# EAGLE design Cis_Honcho (EAGLE 9.6.0)
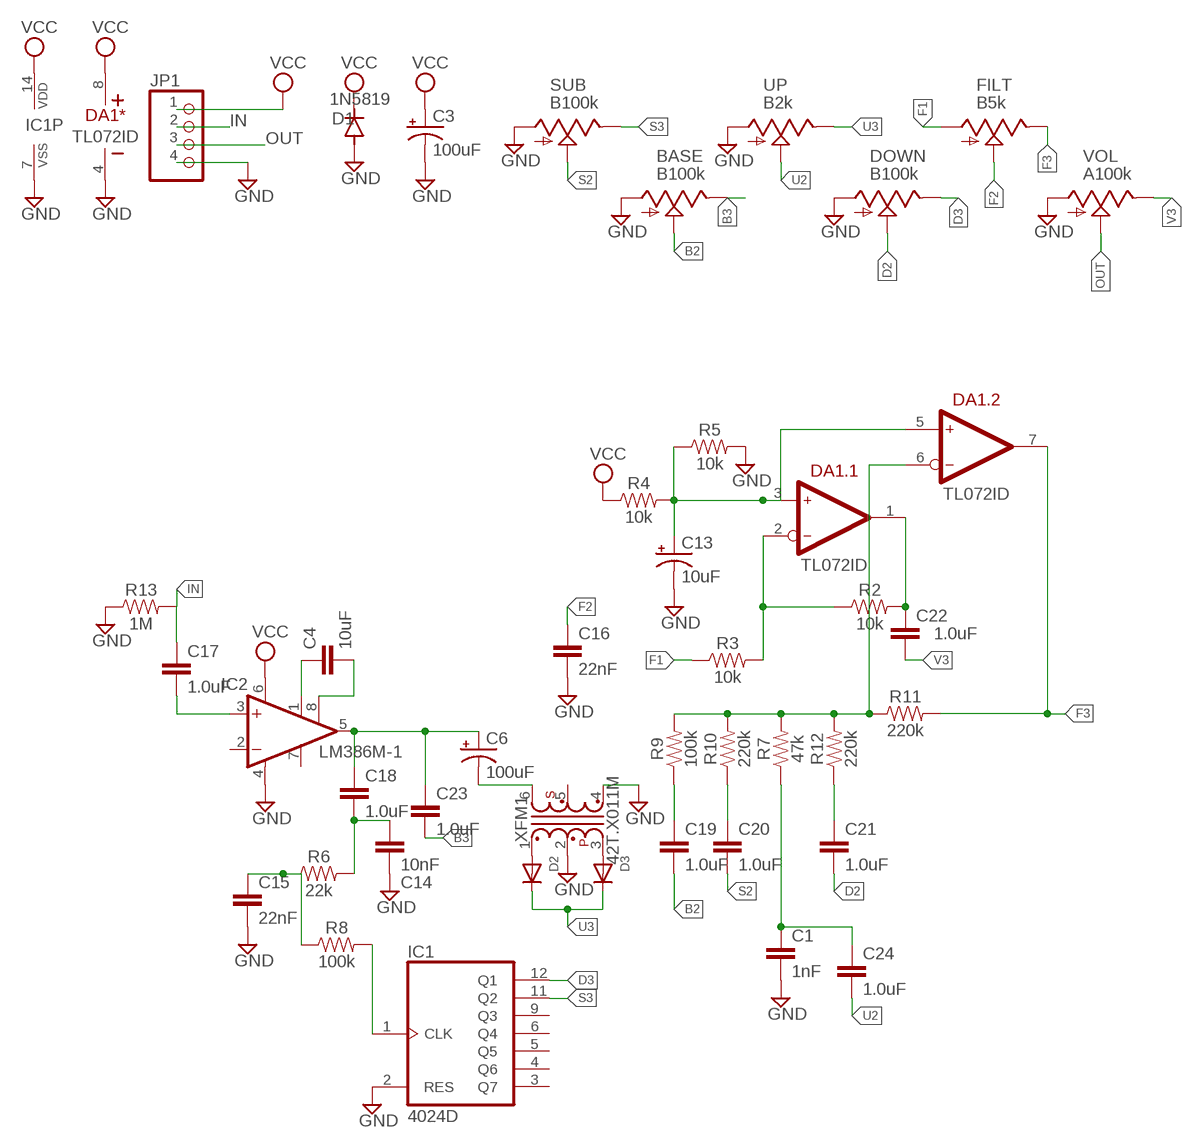
[diagram p0: schematic, sheet 1]

## Parts
BASE  B100k  9MM_SNAP-IN_POT_  [9MM_SNAP-IN_POT]
C1  1nF  1.0NF/1000PF-0603-50V-10%  [0603]
C3  100uF  CPOL-USE2.5-6  [E2,5-6]
C4  10uF  10UF-1210-50V-20%  [1210]
C6  100uF  CPOL-USE2.5-6  [E2,5-6]
C13  10uF  CPOL-USB  [PANASONIC_B]
C14  10nF  10NF-0603-50V-10%  [0603]
C15  22nF  22NF/22,000PF-0603-50V-10%  [0603]
C16  22nF  22NF/22,000PF-0603-50V-10%  [0603]
C17  1.0uF  1.0UF-0603-16V-10%  [0603]
C18  1.0uF  1.0UF-0603-16V-10%  [0603]
C19  1.0uF  1.0UF-0603-16V-10%  [0603]
C20  1.0uF  1.0UF-0603-16V-10%  [0603]
C21  1.0uF  1.0UF-0603-16V-10%  [0603]
C22  1.0uF  1.0UF-0603-16V-10%  [0603]
C23  1.0uF  1.0UF-0603-16V-10%  [0603]
C24  1.0uF  1.0UF-0603-16V-10%  [0603]
D1  1N5819  DIODE-SOD123  [SOD123]
D2  DIODESOD-123  [SOD-123]
D3  DIODESOD-123  [SOD-123]
DA1  TL072ID  [SO-8]
DOWN  B100k  9MM_SNAP-IN_POT_  [9MM_SNAP-IN_POT]
FILT  B5k  9MM_SNAP-IN_POT_  [9MM_SNAP-IN_POT]
IC1  4024D  [SO14]
IC2  LM386M-1  [SO08]
JP1  PINHD-1X4  [1X04]
R2  10k  10KOHM-0603-1/10W-1%  [0603]
R3  10k  10KOHM-0603-1/10W-1%  [0603]
R4  10k  10KOHM-0603-1/10W-1%  [0603]
R5  10k  10KOHM-0603-1/10W-1%  [0603]
R6  22k  22KOHM-0603-1/10W-1%  [0603]
R7  47k  47KOHM-0603-1/10W-1%  [0603]
R8  100k  100KOHM-0603-1/10W-1%  [0603]
R9  100k  100KOHM-0603-1/10W-1%  [0603]
R10  220k  220KOHM-0603-1/10W-1%  [0603]
R11  220k  220KOHM-0603-1/10W-1%  [0603]
R12  220k  220KOHM-0603-1/10W-1%  [0603]
R13  1M  1MOHM-0603-1/4W-5%  [0603]
SUB  B100k  9MM_SNAP-IN_POT_  [9MM_SNAP-IN_POT]
UP  B2k  9MM_SNAP-IN_POT_  [9MM_SNAP-IN_POT]
VOL  A100k  9MM_SNAP-IN_POT_  [9MM_SNAP-IN_POT]
XFM1  42T.X011M  [42TM]

## Nets
B2: BASE.2(S) C19.2
B3: BASE.3(E) C23.2
D2: C21.2 DOWN.2(S)
D3: DOWN.3(E) IC1.12(Q1)
F1: FILT.1(A) R3.1
F2: C16.1 FILT.2(S)
F3: DA1.7(.2:OUT) FILT.3(E) R11.2
GND: BASE.1(A) C1.2 C3.- C13.- C14.2 C15.2 C16.2 D1.A DA1.4(*:V-) DOWN.1(A) IC1.2(RES) IC1.7(VSS) IC2.4(GND) JP1.4 R5.2 R13.1 SUB.1(A) UP.1(A) VOL.1(A) XFM1.2 XFM1.4
IN: C17.1 JP1.2 R13.2
N$1: C17.2 IC2.3(+IN)
N$2: C4.1 IC2.1(GAIN)
N$3: C4.2 IC2.8(GAIN)
N$4: C6.+ C18.1 C23.1 IC2.5(OUT)
N$5: C14.1 C18.2 R6.2
N$6: C15.1 R6.1 R8.1
N$7: IC1.1(CLK) R8.2
N$8: C6.- XFM1.6
N$9: D2.A XFM1.1
N$10: D3.A XFM1.3
N$11: DA1.6(.2:IN-) R7.2 R9.2 R10.2 R11.1 R12.2
N$12: C19.1 R9.1
N$13: C20.1 R10.1
N$14: C21.1 R12.1
N$15: C1.1 C24.1 R7.1
N$16: C13.+ DA1.3(.1:IN+) DA1.5(.2:IN+) R4.2 R5.1
N$17: C22.1 DA1.1(.1:OUT) R2.2
N$18: DA1.2(.1:IN-) R2.1 R3.2
OUT: JP1.3 VOL.2(S)
S2: C20.2 SUB.2(S)
S3: IC1.11(Q2) SUB.3(E)
U2: C24.2 UP.2(S)
U3: D2.C D3.C UP.3(E)
V3: C22.2 VOL.3(E)
VCC: C3.+ D1.C DA1.8(*:V+) IC1.14(VDD) IC2.6(VS) JP1.1 R4.1
Unconnected: IC1.3(Q7) IC1.4(Q6) IC1.5(Q5) IC1.6(Q4) IC1.9(Q3) IC2.2(-IN) IC2.7(BYPASS) XFM1.5

## Library data of the parts
BASE DOWN FILT SUB UP VOL = MusicThingModular:9MM_SNAP-IN_POT: 9mm vertical snap-in pot, Alpha / Panasonic style
C1 = SparkFun-Capacitors:1.0NF/1000PF: 1nF/1,000pF ceramic capacitors A capacitor is a passive two-terminal electrical component used to store electrical energy temporarily in an electric field.; PROD_ID: CAP-07886
C3 C6 = adafruit:CPOL-US: POLARIZED CAPACITOR, American symbol
C4 = SparkFun-Capacitors:10UF: 10.0µF ceramic capacitors A capacitor is a passive two-terminal electrical component used to store electrical energy temporarily in an electric field.; PROD_ID: CAP-09824
C13 = rcl:CPOL-US: POLARIZED CAPACITOR, American symbol; SPICEPREFIX: C
C14 = SparkFun-Capacitors:10NF: 0.01uF/10nF/10,000pF ceramic capacitors A capacitor is a passive two-terminal electrical component used to store electrical energy temporarily in an electric field. CAP-09321; PROD_ID: CAP-00867
C15 C16 = SparkFun-Capacitors:22NF/22,000PF: 0.022uF/22nF/22,000pF ceramic capacitors A capacitor is a passive two-terminal electrical component used to store electrical energy temporarily in an electric field.; PROD_ID: CAP-07885
C17-C24 = SparkFun-Capacitors:1.0UF: 1µF ceramic capacitors A capacitor is a passive two-terminal electrical component used to store electrical energy temporarily in an electric field.; PROD_ID: CAP-00868
D1 = diode:DIODE-: DIODE
D2 D3 = adafruit:DIODE: Diode SMADIODE - SMA Surface Mount Package 20V 1A Schottky Diode Digikey: 641-1014-6-ND DO-1N4148 - Through Hole Small Current Diode SOD-123 20V 1 A (.5mV Vf) Schottky Diode - Digikey: MBRX120TPMSCT-ND SOD-323 10V 570mA (.38mV Vf, 3ns) Schottky Diode - Digikey: ZLLS410CT-ND SOD-523 30V 30mA Schottky Diode (RB751S-40TE61) - Digikey: RB751S-40TE61CT-ND SOT23-R/W - SOT23 Package (R = Solder Paste/Reflow Ovens, W = Hand-Soldering) BAT54Film 40V 300mA - Digikey: 497-7162-1-ND
DA1 = ic-ti:TL072; MOUSER: 511-TL072IDT
IC1 = 40xx:4024: 7-stage binary/ripple COUNTER
IC2 = linear:LM386?-*: Low Voltage Audio Power Amplifier Source: http://cache.national.com/ds/LM/LM386.pdf
JP1 = Connector:PINHD-1X4: PIN HEADER; CATEGORY: CONNECTOR; SUB-CATEGORY: PIN-HEADER
R2-R5 = SparkFun-Resistors:10KOHM: 10kΩ resistor A resistor is a passive two-terminal electrical component that implements electrical resistance as a circuit element. Resistors act to reduce current flow, and, at the same time, act to lower voltage levels within circuits. - Wikipedia; PROD_ID: RES-00824
R6 = SparkFun-Resistors:22KOHM: 22kΩ resistor A resistor is a passive two-terminal electrical component that implements electrical resistance as a circuit element. Resistors act to reduce current flow, and, at the same time, act to lower voltage levels within circuits. - Wikipedia; PROD_ID: RES-07853
R7 = SparkFun-Resistors:47KOHM: 47kΩ resistor A resistor is a passive two-terminal electrical component that implements electrical resistance as a circuit element. Resistors act to reduce current flow, and, at the same time, act to lower voltage levels within circuits. - Wikipedia; PROD_ID: RES-07871
R8 R9 = SparkFun-Resistors:100KOHM: 100kΩ resistor A resistor is a passive two-terminal electrical component that implements electrical resistance as a circuit element. Resistors act to reduce current flow, and, at the same time, act to lower voltage levels within circuits. - Wikipedia; PROD_ID: RES-07828
R10-R12 = SparkFun-Resistors:220KOHM: 220kΩ resistor A resistor is a passive two-terminal electrical component that implements electrical resistance as a circuit element. Resistors act to reduce current flow, and, at the same time, act to lower voltage levels within circuits. - Wikipedia; PROD_ID: RES-08969
R13 = SparkFun-Resistors:1MOHM: 1MΩ resistor A resistor is a passive two-terminal electrical component that implements electrical resistance as a circuit element. Resistors act to reduce current flow, and, at the same time, act to lower voltage levels within circuits. - Wikipedia; PROD_ID: RES-07868
XFM1 = transformer:42T.X: Xicon Micro-Mini EI-12 Audio Transformers 42TL/42TC/42TM Series Source: http://www.mouser.com//catalog/specsheets/164201.pdf http://www.mouser.com/catalog/specsheets/114225.pdf http://www.mouser.com/catalog/specsheets/164267.pdf

## Board
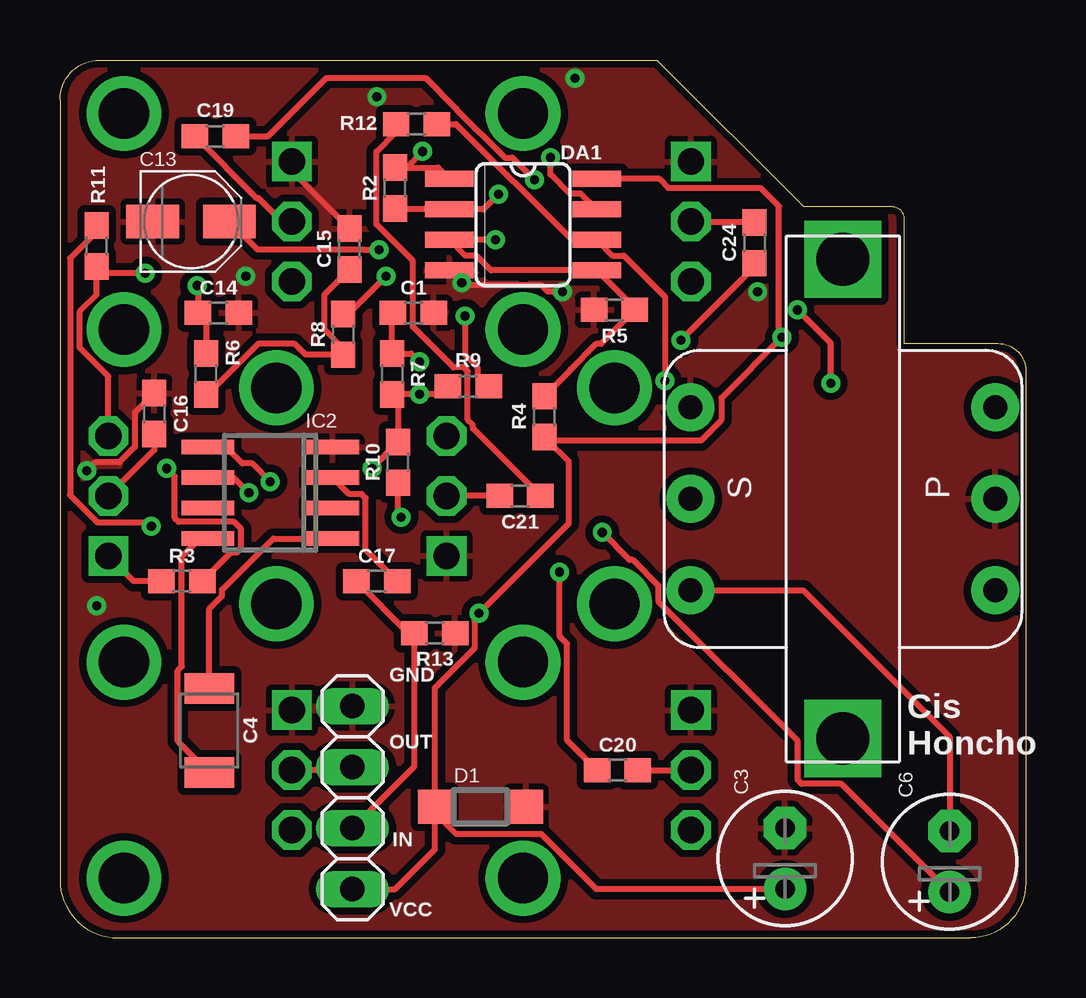
[diagram p1: board, top side]
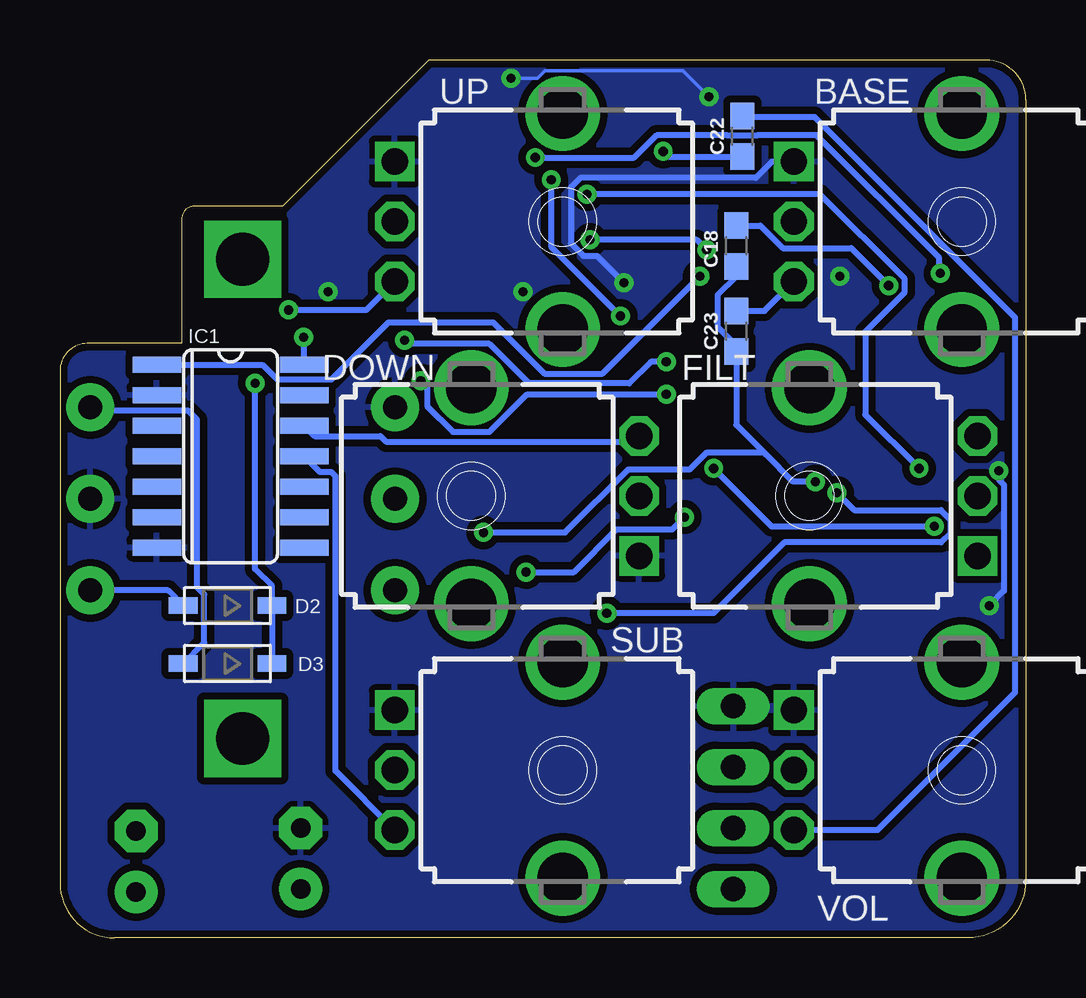
[diagram p2: board, bottom side, seen from below]

Size 40.26 x 36.58 mm. Coordinates in mm from the lower left corner, seen from the top.
Outline: 2.41,0 37.97,0 arc90 40.26,2.29 40.26,23.62 arc90 39.12,24.77 35.18,24.77 35.18,29.97 arc90 34.67,30.48 30.99,30.48 24.89,36.58 1.65,36.58 arc90 0,34.92 0,2.41 arc90 2.41,0
Copper layers (1*16): Top 0.035mm / dielectric 1.5mm / Bottom 0.035mm
Design rules "default *": minimum track width 6mil, minimum drill 0.35mm, track to track 6mil, track to pad 6mil, pad to pad 6mil, via to via 6mil, smd to smd 6mil, copper to edge 6mil, drill to drill 6mil, minimum pad ring 10mil, minimum via ring 8mil, stop-mask expansion 4mil, vias tented up to drill 0mil, thermal gap 10mil

### Footprints (pad centres in the part's own frame; a part is rotated, then mirrored left to right if it is on the bottom)
9MM_SNAP-IN_POT = drill 1.1 square: 1 -2.5,-7 | drill 1.1 octagon: 2 0,-7; 3 2.5,-7 | drill 2.1 pad 2.794: CHASSIS1 -4.5,0; CHASSIS2 4.5,0
0603 = smd 1.1 x 1: 1 -0.85,0; 2 0.85,0
E2,5-6 = drill 0.813 pad 1.778: + -1.27,0 | drill 0.813 pad 1.778 octagon: - 1.27,0
1210 = smd 1.27 x 2.06: 1 -1.755,0; 2 1.755,0
PANASONIC_B = smd 2.2 x 1.4: + 1.6,0; - -1.6,0
SOD123 = smd 1.4 x 1.4: A 1.9,0; C -1.9,0
SOD-123 = smd 1.2 x 0.7: A 1.85,0; C -1.85,0
SO-8 = smd 0.66 x 2.032: 1 -1.905,-3.073; 2 -0.635,-3.073; 3 0.635,-3.073; 4 1.905,-3.073; 5 1.905,3.073; 6 0.635,3.073; 7 -0.635,3.073; 8 -1.905,3.073
SO14 = smd 0.66 x 2.032: 1 -3.81,-3.073; 2 -2.54,-3.073; 3 -1.27,-3.073; 4 0,-3.073; 5 1.27,-3.073; 6 2.54,-3.073; 7 3.81,-3.073; 8 3.81,3.073; 9 2.54,3.073; 10 1.27,3.073; 11 0,3.073; 12 -1.27,3.073; 13 -2.54,3.073; 14 -3.81,3.073
SO08 = smd 0.6 x 2.2: 1 -1.905,-2.6; 2 -0.635,-2.6; 3 0.635,-2.6; 4 1.905,-2.6; 5 1.905,2.6; 6 0.635,2.6; 7 -0.635,2.6; 8 -1.905,2.6
1X04 = drill 1.016 long: 1 -3.81,0; 2 -1.27,0; 3 1.27,0; 4 3.81,0
42TM = drill 1 pad 2: 1 -3.81,-6.35; 2 0,-6.35; 3 3.81,-6.35; 4 3.81,6.35; 5 0,6.35; 6 -3.81,6.35 | drill 2.2 square: P$1 -9.982,0; P$2 9.982,0

### Placement (x,y rotation side)
BASE  2.67,29.84 270 bottom
C1  14.73,26.04 0 top
C3  30.23,3.3 90 top
C4  6.22,8.64 270 top
C6  37.08,3.17 90 top
C13  5.46,29.84 0 top
C14  6.6,26.04 0 top
C15  12.06,28.7 90 top
C16  3.94,21.84 90 top
C17  13.21,14.86 0 top
C18  12.06,28.83 90 bottom
C19  6.48,33.4 180 top
C20  23.24,6.99 0 top
C21  19.18,18.41 180 top
C22  11.81,33.4 90 bottom
C23  12.06,25.27 90 bottom
C24  28.96,28.96 90 top
D1  17.53,5.46 0 top
D2  33.27,13.84 180 bottom
D3  33.27,11.43 180 bottom
DA1  19.3,29.72 270 top
DOWN  23.11,18.41 90 bottom
FILT  9.02,18.41 90 bottom
IC1  33.15,20.07 270 bottom
IC2  8.76,18.54 90 top
JP1  12.19,5.84 90 top
R2  13.97,31.24 90 top
R3  5.08,14.86 0 top
R4  20.19,21.72 90 top
R5  23.11,26.16 180 top
R6  6.1,23.5 90 top
R7  13.84,23.5 270 top
R8  11.81,25.15 90 top
R9  17.02,22.99 180 top
R10  14.1,19.81 90 top
R11  1.52,28.83 270 top
R12  14.86,33.91 0 top
R13  15.62,12.7 180 top
SUB  19.3,6.99 270 bottom
UP  19.3,29.84 270 bottom
VOL  2.67,6.99 270 bottom
XFM1  32.64,18.29 90 top

### Tracks (layer width: path | path; a pad name or v marks a point on that pad's centre or on a via)
B2
  Top 0.254: C19.2 8.2,30.82 8.28,30.82 9.26,29.84 BASE.2
B3
  Bottom 0.254: C23.2 10.89,26.12 BASE.3
D2
  Top 0.254: C21.2 DOWN.2
D3
  Bottom 0.254: IC1.12 29.64,20.9 26.91,20.9 26.67,20.67 16.36,20.67 DOWN.3
F1
  Top 0.254: R3.1 3.07,14.86 FILT.1
F2
  Top 0.254: C16.1 3.94,20.34 FILT.2
F3  (via drill 0.38)
  Top 0.254: FILT.3 2.02,23.4 0.83,24.58 0.83,26.11 1.52,26.8 R11.2 1.82,27.69 v3.56,27.69 | DA1.7 21.72,31.01 21.25,31.01 20.45,31.81 v20.45,32.51
  Bottom 0.254: v20.45,32.51 20.07,32.51 16.32,32.51 15.39,33.44 12.44,33.44 12.43,33.42 11.2,33.42 11.17,33.45 8.73,33.45 3.61,28.33 3.61,27.69 v3.56,27.69
GND  (via drill 0.38)
  Top 0.254: v20.95,26.92 20.32,26.92 20.07,27.18 16.86,27.18 v16.75,27.29 DA1.4 | C16.2 3.12,21.88 3.12,20.46 2.47,19.81 1.47,19.81 v1.12,19.46 | C15.2 9.67,31.95 BASE.1
  Bottom 0.152: v21.46,35.81 20.36,35.81 20.04,36.13 14.29,36.13 v13.21,35.05
  Bottom 0.254: BASE.1 10.57,32.34 11.26,31.66 18.57,31.66 18.96,31.27 18.96,28.93 18.44,28.41 17.87,28.41 v16.75,27.29 | v1.12,19.46 1.12,19.08 0.91,18.87 0.91,14.45 v1.52,13.84
  other vias: 29.08,26.92 7.75,27.56
  pour Top (isolate 0.305): -0.25,36.7 -0.25,-0.51 -0.51,-0.76 40.64,-0.76 40.89,-0.51 40.89,37.08 40.77,37.21 0.13,37.21 -0.25,36.83
  pour Bottom (isolate 0.305): -0.25,37.08 -0.25,-0.64 -0.38,-0.76 40.64,-0.76 40.89,-0.51 40.89,36.96 40.64,37.21 -0.25,37.21
IN
  Top 0.254: C17.1 14.52,12.7 R13.2 14.77,7.15 JP1.2
N$1
  Top 0.254: C17.2 12.74,16.18 12.74,18.32 12.58,18.49 12.05,18.49 IC2.3
N$2
  Top 0.254: C4.1 6.22,13.71 6.76,14.24 6.76,14.51 8.89,16.64 IC2.1
N$3
  Top 0.254: C4.2 4.91,8.19 4.91,11.14 5.08,11.31 5.08,15.88 5.84,16.64 IC2.8
N$4  (via drill 0.38)
  Top 0.254: C6.+ 32.57,6.42 30.91,6.42 30.75,6.58 30.75,8.21 24.95,14.01 24.95,14.68 23.88,15.75 23.75,15.75 v22.61,16.89 | v8.76,19.01 8,19.77 7.6,19.77 6.92,20.45 IC2.5
  Bottom 0.254: 10.92,20.23 13.29,20.23 14,19.52 16.57,19.52 19.2,16.89 v22.61,16.89 | C18.1 12.06,27.57 12.84,26.79 12.84,25.46 12.06,24.68 C23.1 12.06,21.37 10.92,20.23 | 10.92,20.23 10.84,20.15 9.7,19.01 v8.76,19.01
N$5  (via drill 0.38)
  Top 0.254: R6.2 6.1,25.69 C14.1 5.75,27.14 v5.71,27.18
  Bottom 0.254: C18.2 11.06,29.68 10.12,28.74 7.28,28.74 v5.71,27.18
N$6
  Top 0.254: R6.1 6.15,22.64 8.26,24.75 9.78,24.75 10.23,24.3 R8.1 11.81,24.55 11.03,25.33 11.03,26.82 C15.1
N$7  (via drill 0.38)
  Top 0.254: v13.59,27.56 12.03,26 R8.2
  Bottom 0.254: IC1.1 31.82,23.88 31.2,23.27 28.94,23.27 26.57,25.64 22.2,25.64 20.07,23.51 17.64,23.51 v13.59,27.56
N$8
  Top 0.254: XFM1.6 30.99,14.48 37.08,8.38 C6.-
N$9
  Bottom 0.254: D2.A 35.76,14.48 XFM1.1
N$10
  Bottom 0.254: D3.A 34.24,12.31 34.24,14.31 34.54,14.61 34.54,21.59 34.92,21.97 38.86,21.97 XFM1.3
N$11  (via drill 0.38)
  Top 0.254: R9.2 15.83,22.64 v14.99,22.64 R7.2 14.1,22.39 R10.2 13.01,19.57 v13.01,19.56 | R12.2 16.51,33.91 21.34,29.08 DA1.6 23.04,28.42 23.51,28.42 25.22,26.71 v25.22,23.21 | R11.1 1.52,29.42 0.42,28.32 0.42,18.45 1.56,17.31 3.64,17.31 v3.81,17.14
  Bottom 0.254: v25.22,23.21 24.95,22.95 24.95,22.15 23.88,21.08 22.35,21.08 20.79,22.64 v14.99,22.64 | v3.81,17.14 10.6,17.14 v13.01,19.56
N$12  (via drill 0.38)
  Top 0.254: C19.1 8.68,33.4 11.11,35.83 15.23,35.83 16.54,34.52 16.54,34.51 18.54,32.51 18.86,32.51 v19.78,31.59 | R9.1 17.4,23.45 17.4,23.77 16.89,24.28 v16.89,25.91
  Bottom 0.254: v19.78,31.59 19.78,28.8 v16.89,25.91
N$13  (via drill 0.38)
  Top 0.254: v20.83,15.24 20.83,12.56 21.14,12.25 21.14,8.23 C20.1 | v14.22,17.53 14.1,17.65 R10.1
  Bottom 0.254: v20.83,15.24 18.83,15.24 17.05,17.02 14.73,17.02 v14.22,17.53
N$14
  Top 0.254: C21.1 17.22,21.22 17.22,21.37 17,21.59 17,23.6 16.83,23.77 16.41,23.77 14.71,25.46 14.71,28.2 13.19,29.73 13.19,32.76 14.01,33.58 R12.1
N$15  (via drill 0.38)
  Top 0.254: C1.1 13.84,26 R7.1 14.64,24.34 v14.99,24 | v25.89,24.89 28.96,27.96 C24.1
  Bottom 0.254: v25.89,24.89 25.75,24.75 22.35,24.75 20.7,23.1 16.53,23.1 15.63,24 v14.99,24
N$16  (via drill 0.38)
  Top 0.254: v13.3,28.67 12.7,28.67 12.68,28.68 8.22,28.68 C13.+ | v18.16,29.08 DA1.3 16.89,28.42 17.36,28.42 17.97,27.81 DA1.5 23.96,26.23 R5.1 22.55,24.75 22.35,24.75 21.28,23.68 21.28,23.65 R4.2
  Bottom 0.254: v13.3,28.67 13.72,29.08 v18.16,29.08
N$17  (via drill 0.38)
  Top 0.254: DA1.1 15.76,32.09 R2.2 14.44,32.09 v15.11,32.77
  Bottom 0.254: v15.11,32.77 14.9,32.55 C22.1
N$18  (via drill 0.38)
  Top 0.254: R2.1 14.01,30.35 DA1.2 17.65,30.35 v18.29,30.99 | v4.45,19.56 4.78,19.22 4.78,17.49 4.95,17.33 7.27,17.33 7.54,17.05 7.54,16.22 7.38,16.06 7.13,16.06 R3.2
  Bottom 0.254: v18.29,30.99 8.57,30.99 5.04,27.46 5.04,26.9 6.69,25.25 6.69,21.8 v4.45,19.56
OUT
  Top 0.254: JP1.3 12.06,6.99 VOL.2
S2
  Top 0.254: C20.2 SUB.2
S3
  Bottom 0.254: IC1.11 29.41,19.41 28.94,19.41 28.78,19.24 28.78,6.96 SUB.3
U2
  Top 0.254: UP.2 28.92,29.84 C24.2
U3  (via drill 0.38)
  Top 0.254: v32.13,23.11 32.13,24.77 v30.73,26.16
  Bottom 0.254: D3.C D2.C 31.42,14.66 32.13,15.37 v32.13,23.11 | v30.73,26.16 27.49,26.16 UP.3
V3
  Bottom 0.254: C22.2 11.77,34.21 8.81,34.21 0.45,25.85 0.45,10.22 6.18,4.49 VOL.3
VCC  (via drill 0.38)
  Top 0.254: JP1.1 13.97,2.03 15.63,3.69 15.63,5.21 | 15.63,5.21 D1.C 15.63,10.41 17.3,12.08 17.3,13.36 v17.46,13.53 21.21,17.27 21.21,19.85 20.34,20.72 | C3.+ 22.36,2.03 20.07,4.32 16.51,4.32 15.63,5.21 | 20.34,20.72 R4.1 | 20.34,20.72 26.72,20.72 27.57,21.57 27.57,22.49 v30.1,25.02 29.97,25.15 29.97,30.48 29.21,31.24 25.36,31.24 24.98,31.62 DA1.8 | IC2.6 7.24,19.18 v7.87,18.54
  Bottom 0.254: IC1.14 30.07,24.99 v30.1,25.02 | v17.46,13.53 13.02,13.53 10.07,16.47 3.53,16.47 3.14,16.87 3.14,17.42 3.53,17.82 7.15,17.82 v7.87,18.54

### Text on the board
tPlace: GND | OUT | Cis / Honcho | IN | VCC